# EAGLE schematic main (EAGLE 9.0.0)
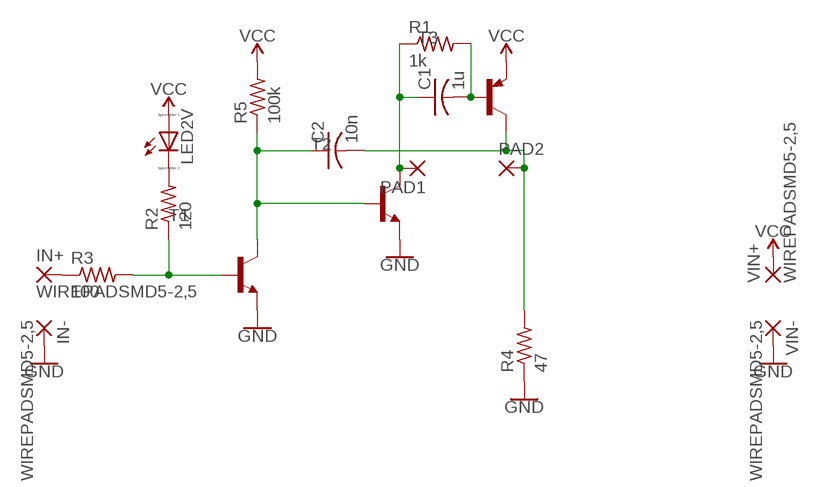
[diagram p0: schematic, sheet 1]

## Parts
C1  1u  C-USC0603  [C0603]
C2  10n  C-USC0603  [C0603]
IN+  WIREPADSMD5-2,5  [5-2,5]
IN-  WIREPADSMD5-2,5  [5-2,5]
LED2V  LED_ESML0603  [LED_SML0603]
PAD1  2,54/1,0  [2,54/1,0]
PAD2  2,54/1,0  [2,54/1,0]
R1  1k  R-US_R0603  [R0603]
R2  120  R-US_R0603  [R0603]
R3  100  R-US_R0603  [R0603]
R4  47  R-US_R0603  [R0603]
R5  100k  R-US_R0603  [R0603]
T1  MMBT3904LT1-NPN-SOT23-BEC  [SOT23-BEC]
T2  MMBT3904LT1-NPN-SOT23-BEC  [SOT23-BEC]
T3  MMBT3906LT1-PNP-SOT23-BEC  [SOT23-BEC]
VIN+  WIREPADSMD5-2,5  [5-2,5]
VIN-  WIREPADSMD5-2,5  [5-2,5]

## Nets
GND: IN-.1(P) R4.1 T1.E T2.E VIN-.1(P)
N$1: C1.2 R1.2 T3.B
N$2: C2.1 R5.1 T1.C T2.B
N$3: C2.2 PAD2.1(P) R4.2 T3.C
N$4: C1.1 PAD1.1(P) R1.1 T2.C
N$5: R2.1 R3.2 T1.B
N$6: LED2V.C R2.2
N$7: IN+.1(P) R3.1
VCC: LED2V.A R5.2 T3.E VIN+.1(P)

## Library data of the parts
C1 C2 = rcl:C-US: CAPACITOR, American symbol; SPICEPREFIX: C
IN+ IN- VIN+ VIN- = wirepad:WIREPAD: Wire PAD connect wire on PCB
LED2V = eagle-ltspice:LED_E: LED Source: http://www.osram.convergy.de Source: www.luxeon.com Source: www.kingbright.com; SPICEMODEL: NONE; SPICEPREFIX: D; SPICETYPE: diode
PAD1 PAD2 = 7_segment_lib:2,54/1,0: THROUGH-HOLE PAD
R1-R5 = resistor:R-US_: RESISTOR, American symbol
T1 T2 = DC_LOAD_AU:*-NPN-: NPN Transistror BF959 corrected 2008.03.06
T3 = DC_LOAD_AU:*-PNP-: PNP Transistror